# Altium schematic sheet Relays.SchDoc
size A
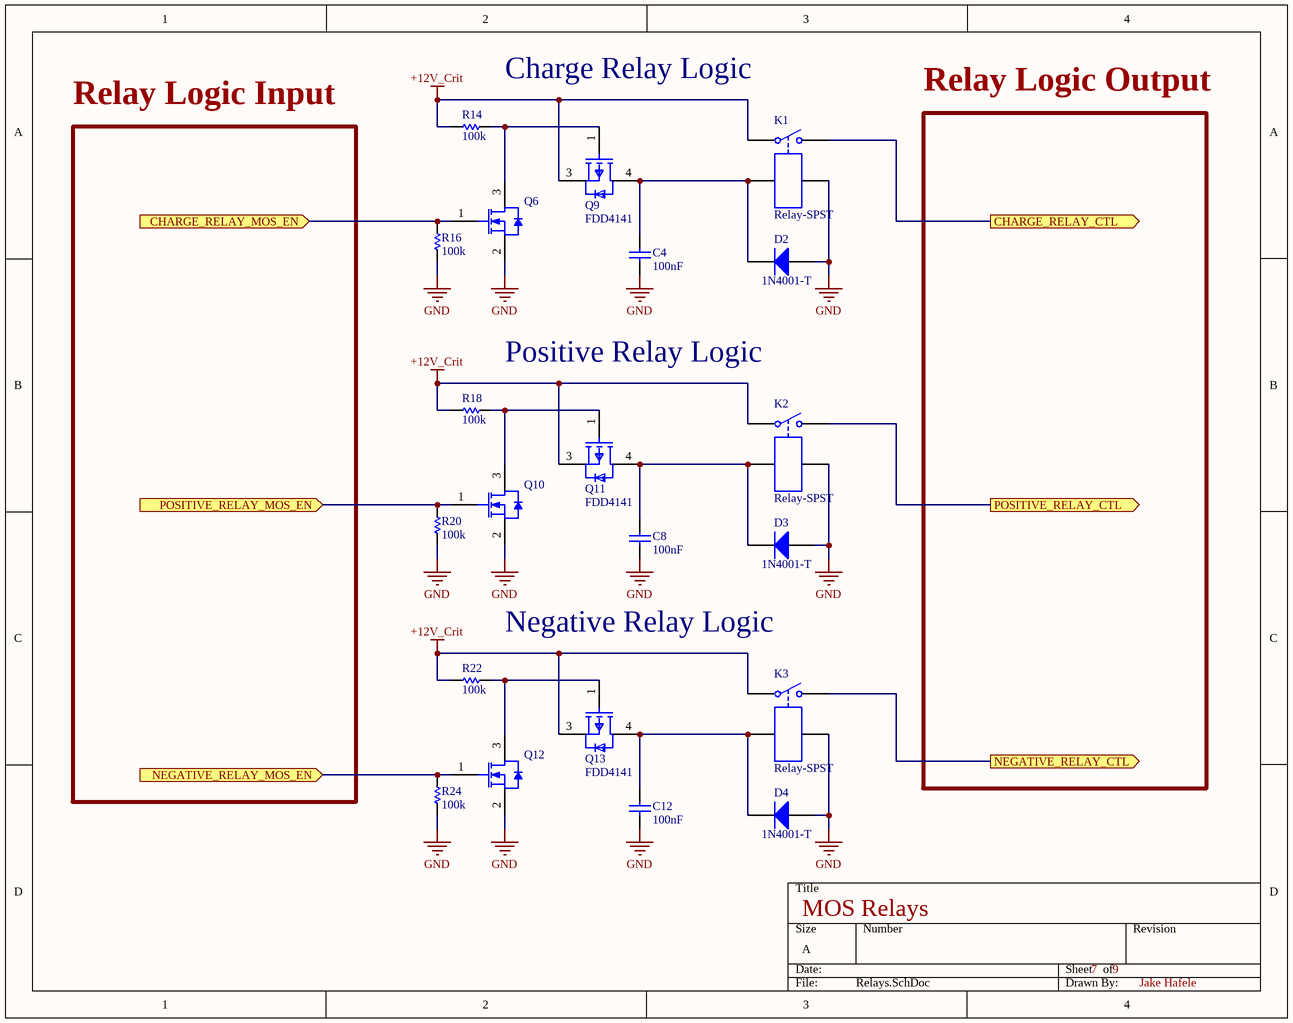
[diagram p0: Relays.SchDoc]

## Parts
C4  100nF  [CAPC2113X120X50LL20T30]
C8  100nF  [CAPC2113X120X50LL20T30]
C12  100nF  [CAPC2113X120X50LL20T30]
D2  1N4001-T  [DIOD-DO-41-P-2_V]
D3  1N4001-T  [DIOD-DO-41-P-2_V]
D4  1N4001-T  [DIOD-DO-41-P-2_V]
K1  Relay-SPST  [Realy (G5CA)]
K2  Relay-SPST  [Realy (G5CA)]
K3  Relay-SPST  [Realy (G5CA)]
Q6  FDN337N  [FAIR-SSOT3L-3_V]  (value not drawn)
Q9  FDD4141  [FP-369AS-MFG]
Q10  FDN337N  [FAIR-SSOT3L-3_V]  (value not drawn)
Q11  FDD4141  [FP-369AS-MFG]
Q12  FDN337N  [FAIR-SSOT3L-3_V]  (value not drawn)
Q13  FDD4141  [FP-369AS-MFG]
R14  SchematicInformation: 100k  [R_0603]  (hidden comment: RES_100k_1%_0603)
R16  SchematicInformation: 100k  [R_0603]  (hidden comment: RES_100k_1%_0603)
R18  SchematicInformation: 100k  [R_0603]  (hidden comment: RES_100k_1%_0603)
R20  SchematicInformation: 100k  [R_0603]  (hidden comment: RES_100k_1%_0603)
R22  SchematicInformation: 100k  [R_0603]  (hidden comment: RES_100k_1%_0603)
R24  SchematicInformation: 100k  [R_0603]  (hidden comment: RES_100k_1%_0603)

## Ports
CHARGE_RELAY_CTL (out), CHARGE_RELAY_MOS_EN (in), NEGATIVE_RELAY_CTL (out), NEGATIVE_RELAY_MOS_EN (in), POSITIVE_RELAY_CTL (out), POSITIVE_RELAY_MOS_EN (in)

## Nets
+12V_Crit: K1.4 K2.4 K3.4 Q9.3(S) Q11.3(S) Q13.3(S) R14.1 R18.1 R22.1
GND: C4.2 C8.2 C12.2 D2.1(A) D3.1(A) D4.1(A) K1.2 K2.2 K3.2 Q6.2(S) Q10.2(S) Q12.2(S) R16.1 R20.1 R24.1
CHARGE_RELAY_CTL: K1.3 ; port CHARGE_RELAY_CTL
CHARGE_RELAY_MOS_EN: Q6.1(G) R16.2 ; port CHARGE_RELAY_MOS_EN
NEGATIVE_RELAY_CTL: K3.3 ; port NEGATIVE_RELAY_CTL
NEGATIVE_RELAY_MOS_EN: Q12.1(G) R24.2 ; port NEGATIVE_RELAY_MOS_EN
POSITIVE_RELAY_CTL: K2.3 ; port POSITIVE_RELAY_CTL
POSITIVE_RELAY_MOS_EN: Q10.1(G) R20.2 ; port POSITIVE_RELAY_MOS_EN
NetC4_1: C4.1 D2.2(K) K1.1 Q9.4(D)
NetC8_1: C8.1 D3.2(K) K2.1 Q11.4(D)
NetC12_1: C12.1 D4.2(K) K3.1 Q13.4(D)
NetQ6_3: Q6.3(D) Q9.1(G) R14.2
NetQ10_3: Q10.3(D) Q11.1(G) R18.2
NetQ12_3: Q12.3(D) Q13.1(G) R22.2

## Notes on the sheet
- Charge Relay Logic
- Relay Logic Output
- Relay Logic Input
- Positive Relay Logic
- Negative Relay Logic
- MOS Relays
- 7
- 9
- Jake Hafele

## Library data of the parts
C4 C8 C12 = CMP-2007-04056-1: TAJR104K035RNJ; Manufacturer: AVX Interconnect / Elco; Part Number: TAJR104K035RNJ
D2-D4 = CMP-0639-00006-2: 1.0 A Rectifier, 15 pF, 50 V, -65 to 150 degC, 2-Pin DO-41 Plastic, RoHS, Tape and Reel; Manufacturer: Diodes Inc; VF (V): 1; CT (pF): 15; Max. IR (uA): 5; VRRM (V): 50; Max. IFSM (A): 30; RoHS: TRUE; Mounting Technology: Through Hole; PartNumber: 1N4001-T; ComponentLink2Description: Datasheet; DatasheetVersion: Rev. 8-2; Operating Temperature Range (degC): -65 to 150; Packing: Tape and Reel; PackageReference: DO-41-P-2; ComponentLink1URL: http://diodes.com/; PackageDescription: 2-Pin Axial Lead, Body 4.635 x 2.36 mm, Lead Spread 25.4 mm; ComponentLink2URL: http://diodes.com/datasheets/ds28002.pdf; Max. Average Rectified Current IO (A): 1; ComponentLink1Description: Manufacturer URL
K1-K3 = Relay-SPST: Single-Pole Single-Throw Relay; Published: 24-Mar-1999; LatestRevisionDate: 17-Jul-2002; LatestRevisionNote: Re-released for DXP Platform.; PackageReference: MODULE4; Publisher: Altium Limited
Q6 Q10 Q12 = CMP-2000-06250-1: N-Channel Logic Level Enhancement Mode Field Effect Transistor,2.2 A, 30 V, -55 to 150 degC, 3-Pin SOT-23, RoHS, Tape and Reel; Manufacturer: Fairchild Semiconductor; Transistor Polarity: NChannel; RDS(on): 0.082Ohm; External Depth: 2.5mm; Reel Quantity: 3000; Threshold Voltage Vgs Typ: 700mV; Current Id Max: 2.2A; External Length / Height: 1.12mm; No. of Pins: 3; Vgss: +/-8V; Voltage Vgs Rds on Measurement: 4.5V; Power Dissipation Pd: 500mW; Full Power Rating Temperature: 25°C; Pulse Current Idm: 10A; Vdss: 30V; Continuous Drain Current Id: 2.5A; SMD Marking: 337; No. of Transistors: 1; SVHC: NoSVHC(19-Dec-2012); Package Version: Rev. 3, 05/2015; Vth: 0.7V; Drain Source Voltage Vds: 20V; On Resistance Rds(on): 52mohm; Trr: 10ns; External Width: 3.05mm; Operating Temperature Range: -55°Cto+150°C; Operating Temperature Min: -55°C; Package / Case: SOT-23; Operating Temperature Max: 150°C; Manufacturer URL: https://www.fairchildsemi.com/; Id: 2.2A; Mounting Technology: SurfaceMount; Rds(on) Test Voltage Vgs: 4.5V; Voltage Vds Typ: 30V; Datasheet Version: Rev. C, 03/1998; Transistor Case Style: SOT-23; Termination Type: SMD; Package Reference: SSOT3L; Package Description: 3-Pin Small Outline Transistor, Body 2.92 x 1.4 mm, Pitch 0.95 mm; Voltage Vgs Max: 700mV; Tape Width: 8mm; Datasheet URL: https://www.fairchildsemi.com/datasheets/FD/FDN337N.pdf; Package URL: https://www.fairchildsemi.com/package-drawings/MA/MA03B.pdf; Current Temperature: 25°C
Q9 Q11 Q13 = CMP-07173-000088-1: MOSFET P-CH 40V 10.8A DPAK; Manufacturer: ON Semiconductor; Gate Charge At Vgs: 36nC @ -10V; Transconductance: 38S; Drain To Source Breakdown Voltage: -40V; Reverse Recovery Time: 29ns; Pulse Drain Current: -100A; Reverse Recovery Charge: 26nC; Drain To Source Resistance: 10.1mΩ; Power Dissipation: 2.4W; Max Forward Diode Voltage: -1.2V; Turn Off Delay Time: 38ns; Number Of P Channels: 1; Gate To Source Voltage: 20V; Rthja Max: 52°C/W; Depletion Mode: False; Threshold Vgs Max: -3V; Threshold Vgs Min: -1V; Turn On Delay Time: 10ns; Max Junction Temp: +150°C; Input Capacitace At Vds: 2085pF @ -20V; Continuous Drain Current: -10.8A; Typ Forward Diode Voltage: -0.8V; Package: 369AS; Category: Diode; RoHS: TRUE; Device Class L2: Transistors; Octopart: https://octopart.com/fdd4141-on+semiconductor-84325802; Temperature: -55°C to +150°C; Drain To Source Voltage: -40V; Device Class L1: Discrete Semiconductors; Temperature Range Low: -55°C; Height: 2.517mm; ComponentLink2Description: Datasheet; Automotive: No; Number Of Channels: 1; Digikey Description: MOSFET P-CH 40V 10.8A DPAK; Lead Free: Yes; Manufacturer Part Number: FDD4141; Temperature Range High: +150°C; Footprint Url: https://www.onsemi.com/pub/Collateral/369AS.PDF; Device Class L3: MOSFETs; Mouser Description: MOSFET -40V P-Channel PowerTrench; ComponentLink2URL: https://www.onsemi.com/pub/Collateral/FDD4141-D.pdf
R14 R16 R18 R20 R22 R24 = RES_100k_1%_0603: Manufacturer Part Number: RC0603FR-07100KL; Manufacturer: Yageo; DigiKey Part Number: 311-100KHRCT-ND